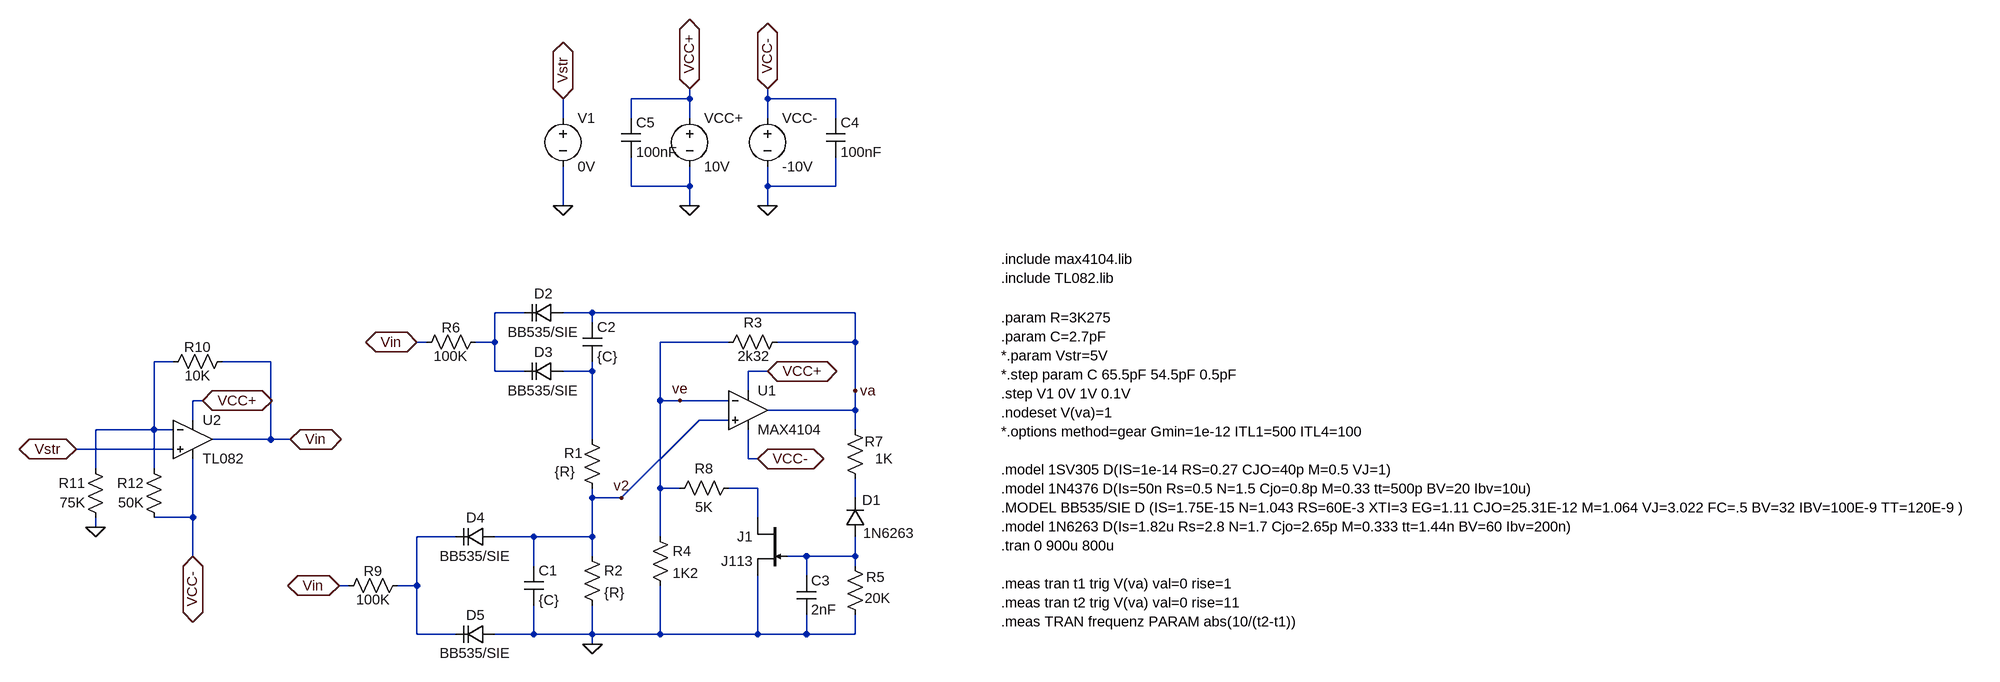
[diagram p0: schematic Wien-LT_TB.asc]
Wien-LT_TB.asc, the LTspice schematic file:
Version 4
SHEET 1 2820 680
WIRE 352 -3056 352 -3072
WIRE 352 -3056 256 -3056
WIRE 480 -3056 480 -3072
WIRE 592 -3056 480 -3056
WIRE 144 -3024 144 -3056
WIRE 256 -3024 256 -3056
WIRE 352 -3024 352 -3056
WIRE 480 -3024 480 -3056
WIRE 592 -3024 592 -3056
WIRE 256 -2912 256 -2960
WIRE 352 -2912 352 -2944
WIRE 352 -2912 256 -2912
WIRE 480 -2912 480 -2944
WIRE 592 -2912 592 -2960
WIRE 592 -2912 480 -2912
WIRE 144 -2880 144 -2944
WIRE 352 -2880 352 -2912
WIRE 480 -2880 480 -2912
WIRE 80 -2704 32 -2704
WIRE 192 -2704 144 -2704
WIRE 624 -2704 192 -2704
WIRE 192 -2688 192 -2704
WIRE -80 -2656 -96 -2656
WIRE 32 -2656 32 -2704
WIRE 32 -2656 0 -2656
WIRE 416 -2656 304 -2656
WIRE 624 -2656 624 -2704
WIRE 624 -2656 496 -2656
WIRE -496 -2624 -528 -2624
WIRE -336 -2624 -416 -2624
WIRE 32 -2608 32 -2656
WIRE 80 -2608 32 -2608
WIRE 192 -2608 192 -2624
WIRE 192 -2608 144 -2608
WIRE 480 -2608 448 -2608
WIRE 448 -2576 448 -2608
WIRE 624 -2576 624 -2656
WIRE -448 -2560 -464 -2560
WIRE 304 -2560 304 -2656
WIRE 336 -2560 304 -2560
WIRE 416 -2560 336 -2560
WIRE 624 -2544 624 -2576
WIRE 624 -2544 480 -2544
WIRE -464 -2528 -464 -2560
WIRE 416 -2528 368 -2528
WIRE -528 -2512 -528 -2624
WIRE -528 -2512 -624 -2512
WIRE -496 -2512 -528 -2512
WIRE 624 -2512 624 -2544
WIRE -336 -2496 -336 -2624
WIRE -336 -2496 -432 -2496
WIRE -304 -2496 -336 -2496
WIRE 192 -2496 192 -2608
WIRE -496 -2480 -656 -2480
WIRE 448 -2464 448 -2512
WIRE 464 -2464 448 -2464
WIRE -624 -2448 -624 -2512
WIRE -528 -2448 -528 -2512
WIRE 304 -2416 304 -2560
WIRE 336 -2416 304 -2416
WIRE 464 -2416 416 -2416
WIRE 192 -2400 192 -2416
WIRE 240 -2400 368 -2528
WIRE 240 -2400 192 -2400
WIRE 624 -2400 624 -2432
WIRE -464 -2368 -464 -2464
WIRE -464 -2368 -528 -2368
WIRE 464 -2368 464 -2416
WIRE -624 -2352 -624 -2368
WIRE -32 -2336 -96 -2336
WIRE 96 -2336 32 -2336
WIRE 192 -2336 192 -2400
WIRE 192 -2336 96 -2336
WIRE 304 -2336 304 -2416
WIRE -464 -2304 -464 -2368
WIRE 192 -2304 192 -2336
WIRE 544 -2304 512 -2304
WIRE 624 -2304 624 -2336
WIRE 624 -2304 544 -2304
WIRE 96 -2288 96 -2336
WIRE 624 -2288 624 -2304
WIRE 544 -2272 544 -2304
WIRE -208 -2256 -224 -2256
WIRE -96 -2256 -96 -2336
WIRE -96 -2256 -128 -2256
WIRE -96 -2176 -96 -2256
WIRE -32 -2176 -96 -2176
WIRE 96 -2176 96 -2224
WIRE 96 -2176 32 -2176
WIRE 192 -2176 192 -2224
WIRE 192 -2176 96 -2176
WIRE 304 -2176 304 -2256
WIRE 304 -2176 192 -2176
WIRE 464 -2176 464 -2272
WIRE 464 -2176 304 -2176
WIRE 544 -2176 544 -2208
WIRE 544 -2176 464 -2176
WIRE 624 -2176 624 -2208
WIRE 624 -2176 544 -2176
WIRE 192 -2160 192 -2176
FLAG 192 -2160 0
FLAG 352 -3072 VCC+
IOPIN 352 -3072 BiDir
FLAG 480 -3072 VCC-
IOPIN 480 -3072 BiDir
FLAG 480 -2608 VCC+
IOPIN 480 -2608 BiDir
FLAG 464 -2464 VCC-
IOPIN 464 -2464 BiDir
FLAG 480 -2880 0
FLAG 352 -2880 0
FLAG 336 -2560 ve
FLAG 624 -2576 va
FLAG 240 -2400 v2
FLAG 144 -2880 0
FLAG 144 -3056 Vstr
IOPIN 144 -3056 BiDir
FLAG -448 -2560 VCC+
IOPIN -448 -2560 BiDir
FLAG -464 -2304 VCC-
IOPIN -464 -2304 BiDir
FLAG -304 -2496 Vin
IOPIN -304 -2496 BiDir
FLAG -96 -2656 Vin
IOPIN -96 -2656 BiDir
FLAG -224 -2256 Vin
IOPIN -224 -2256 BiDir
FLAG -656 -2480 Vstr
IOPIN -656 -2480 BiDir
FLAG -624 -2352 0
SYMBOL cap 80 -2288 R0
SYMATTR InstName C1
SYMATTR Value {C}
SYMBOL cap 176 -2688 R0
SYMATTR InstName C2
SYMATTR Value {C}
SYMBOL res 176 -2320 R0
SYMATTR InstName R2
SYMATTR Value {R}
SYMBOL res 288 -2352 R0
SYMATTR InstName R4
SYMATTR Value 1K2
SYMBOL res 432 -2432 R90
WINDOW 0 0 56 VBottom 2
WINDOW 3 32 56 VTop 2
SYMATTR InstName R8
SYMATTR Value 5K
SYMBOL res 640 -2192 R180
WINDOW 0 -33 78 Left 2
WINDOW 3 -42 43 Left 2
SYMATTR InstName R5
SYMATTR Value 20K
SYMBOL res 640 -2416 R180
WINDOW 0 -30 76 Left 2
WINDOW 3 -46 48 Left 2
SYMATTR InstName R7
SYMATTR Value 1K
SYMBOL res 400 -2640 R270
WINDOW 0 32 56 VTop 2
WINDOW 3 8 57 VBottom 2
SYMATTR InstName R3
SYMATTR Value 2k32
SYMBOL res 176 -2512 R0
WINDOW 0 -30 39 Left 2
WINDOW 3 -46 69 Left 2
SYMATTR InstName R1
SYMATTR Value {R}
SYMBOL diode 640 -2336 R180
WINDOW 0 -26 60 Left 2
WINDOW 3 -82 6 Left 2
SYMATTR InstName D1
SYMATTR Value 1N6263
SYMBOL cap 528 -2272 R0
SYMATTR InstName C3
SYMATTR Value 2nF
SYMBOL voltage 480 -3040 R0
WINDOW 123 0 0 Left 0
WINDOW 39 0 0 Left 0
SYMATTR InstName VCC-
SYMATTR Value -10V
SYMBOL voltage 352 -3040 R0
SYMATTR InstName VCC+
SYMATTR Value 10V
SYMBOL njf 512 -2368 M0
SYMATTR InstName J1
SYMATTR Value J113
SYMBOL cap 576 -3024 R0
SYMATTR InstName C4
SYMATTR Value 100nF
SYMBOL cap 240 -3024 R0
SYMATTR InstName C5
SYMATTR Value 100nF
SYMBOL varactor 144 -2720 R90
WINDOW 0 0 32 VBottom 2
WINDOW 3 32 32 VTop 2
SYMATTR InstName D2
SYMATTR Value BB535/SIE
SYMBOL varactor 144 -2624 R90
WINDOW 0 0 32 VBottom 2
WINDOW 3 32 32 VTop 2
SYMATTR InstName D3
SYMATTR Value BB535/SIE
SYMBOL res 16 -2672 R90
WINDOW 0 8 56 VBottom 2
WINDOW 3 24 56 VTop 2
SYMATTR InstName R6
SYMATTR Value 100K
SYMBOL varactor 32 -2352 R90
WINDOW 0 0 32 VBottom 2
WINDOW 3 32 32 VTop 2
SYMATTR InstName D4
SYMATTR Value BB535/SIE
SYMBOL varactor 32 -2192 R90
WINDOW 0 0 32 VBottom 2
WINDOW 3 32 32 VTop 2
SYMATTR InstName D5
SYMATTR Value BB535/SIE
SYMBOL res -112 -2272 R90
WINDOW 0 8 56 VBottom 2
WINDOW 3 24 56 VTop 2
SYMATTR InstName R9
SYMATTR Value 100K
SYMBOL voltage 144 -3040 R0
SYMATTR InstName V1
SYMATTR Value 0V
SYMBOL opamp2 -464 -2560 R0
SYMATTR InstName U2
SYMATTR Value TL082
SYMBOL res -400 -2640 R90
WINDOW 0 8 56 VBottom 2
WINDOW 3 24 56 VTop 2
SYMATTR InstName R10
SYMATTR Value 10K
SYMBOL res -608 -2352 R180
WINDOW 0 32 72 Left 2
WINDOW 3 32 40 Left 2
SYMATTR InstName R11
SYMATTR Value 75K
SYMBOL res -512 -2352 R180
WINDOW 0 32 72 Left 2
WINDOW 3 32 40 Left 2
SYMATTR InstName R12
SYMATTR Value 50K
SYMBOL opamp2 448 -2608 R0
SYMATTR InstName U1
SYMATTR Value MAX4104
TEXT 864 -2696 Left 2 !.param R=3K275\n.param C=2.7pF\n*.param Vstr=5V\n*.step param C 65.5pF 54.5pF 0.5pF\n.step V1 0V 1V 0.1V\n.nodeset V(va)=1\n*.options method=gear Gmin=1e-12 ITL1=500 ITL4=100\n \n.model 1SV305 D(IS=1e-14 RS=0.27 CJO=40p M=0.5 VJ=1)\n.model 1N4376 D(Is=50n Rs=0.5 N=1.5 Cjo=0.8p M=0.33 tt=500p BV=20 Ibv=10u)\n.MODEL BB535/SIE D (IS=1.75E-15 N=1.043 RS=60E-3 XTI=3 EG=1.11 CJO=25.31E-12 M=1.064 VJ=3.022 FC=.5 BV=32 IBV=100E-9 TT=120E-9 )\n.model 1N6263 D(Is=1.82u Rs=2.8 N=1.7 Cjo=2.65p M=0.333 tt=1.44n BV=60 Ibv=200n)\n.tran 0 900u 800u\n \n.meas tran t1 trig V(va) val=0 rise=1\n.meas tran t2 trig V(va) val=0 rise=11\n.meas TRAN frequenz PARAM abs(10/(t2-t1))
TEXT 864 -2792 Left 2 !.include max4104.lib\n.include TL082.lib

The netlist it stands for:
* Wien-LT_TB.asc
C1 v2 0 {C}
C2 va N003 {C}
R2 v2 0 {R}
R4 ve 0 1K2
R8 N004 ve 5K
R5 0 N007 20K
R7 N005 va 1K
R3 ve va 2k32
R1 N003 v2 {R}
D1 N007 N005 1N6263
C3 N007 0 2nF
VCC- VCC- 0 -10V
VCC+ VCC+ 0 10V
J1 N004 N007 0 J113
C4 VCC- 0 100nF
C5 VCC+ 0 100nF
D2 va N001 BB535/SIE
D3 N003 N001 BB535/SIE
R6 N001 Vin 100K
D4 v2 N006 BB535/SIE
D5 0 N006 BB535/SIE
R9 N006 Vin 100K
V1 Vstr 0 0V
XU2 Vstr N002 VCC+ VCC- Vin TL082  ; pins In+ In- V+ V- OUT
R10 Vin N002 10K
R11 0 N002 75K
R12 VCC- N002 50K
XU1 v2 ve VCC+ VCC- va MAX4104  ; pins In+ In- V+ V- OUT
.model D D
.lib standard.dio
.model NJF NJF
.model PJF PJF
.lib standard.jft
.param R=3K275
.param C=2.7pF
*.param Vstr=5V
*.step param C 65.5pF 54.5pF 0.5pF
.step V1 0V 1V 0.1V
.nodeset V(va)=1
*.options method=gear Gmin=1e-12 ITL1=500 ITL4=100
.model 1SV305 D(IS=1e-14 RS=0.27 CJO=40p M=0.5 VJ=1)
.model 1N4376 D(Is=50n Rs=0.5 N=1.5 Cjo=0.8p M=0.33 tt=500p BV=20 Ibv=10u)
.MODEL BB535/SIE D (IS=1.75E-15 N=1.043 RS=60E-3 XTI=3 EG=1.11 CJO=25.31E-12 M=1.064 VJ=3.022 FC=.5 BV=32 IBV=100E-9 TT=120E-9 )
.model 1N6263 D(Is=1.82u Rs=2.8 N=1.7 Cjo=2.65p M=0.333 tt=1.44n BV=60 Ibv=200n)
.tran 0 900u 800u
.meas tran t1 trig V(va) val=0 rise=1
.meas tran t2 trig V(va) val=0 rise=11
.meas TRAN frequenz PARAM abs(10/(t2-t1))
.include max4104.lib
.include TL082.lib
.backanno
.end